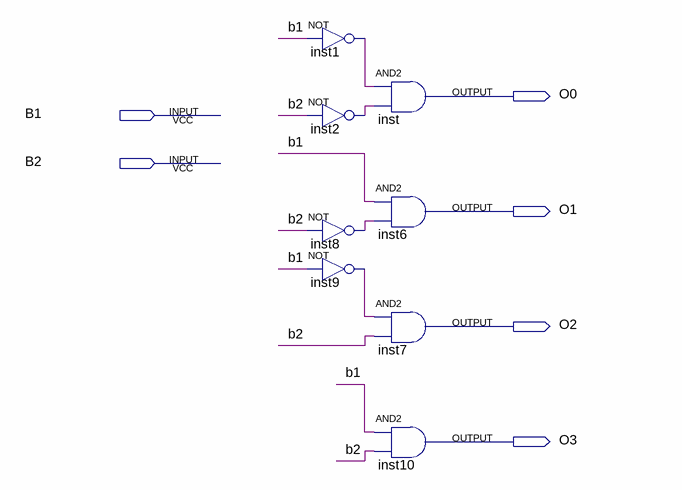
[diagram p0: schematic sheet]
// Quartus schematic CD4.bdf as structural Verilog: 8 symbols, 6 pins
module CD4 (
  input  B1,
  input  B2,
  output O0,
  output O1,
  output O2,
  output O3
);

  wire inst1_out, inst2_out, inst8_out, inst9_out;

  not inst1 (inst1_out, B1);
  not inst2 (inst2_out, B2);
  not inst8 (inst8_out, B2);
  not inst9 (inst9_out, B1);
  and inst (O0, inst1_out, inst2_out);
  and inst6 (O1, B1, inst8_out);
  and inst7 (O2, inst9_out, B2);
  and inst10 (O3, B1, B2);
endmodule
